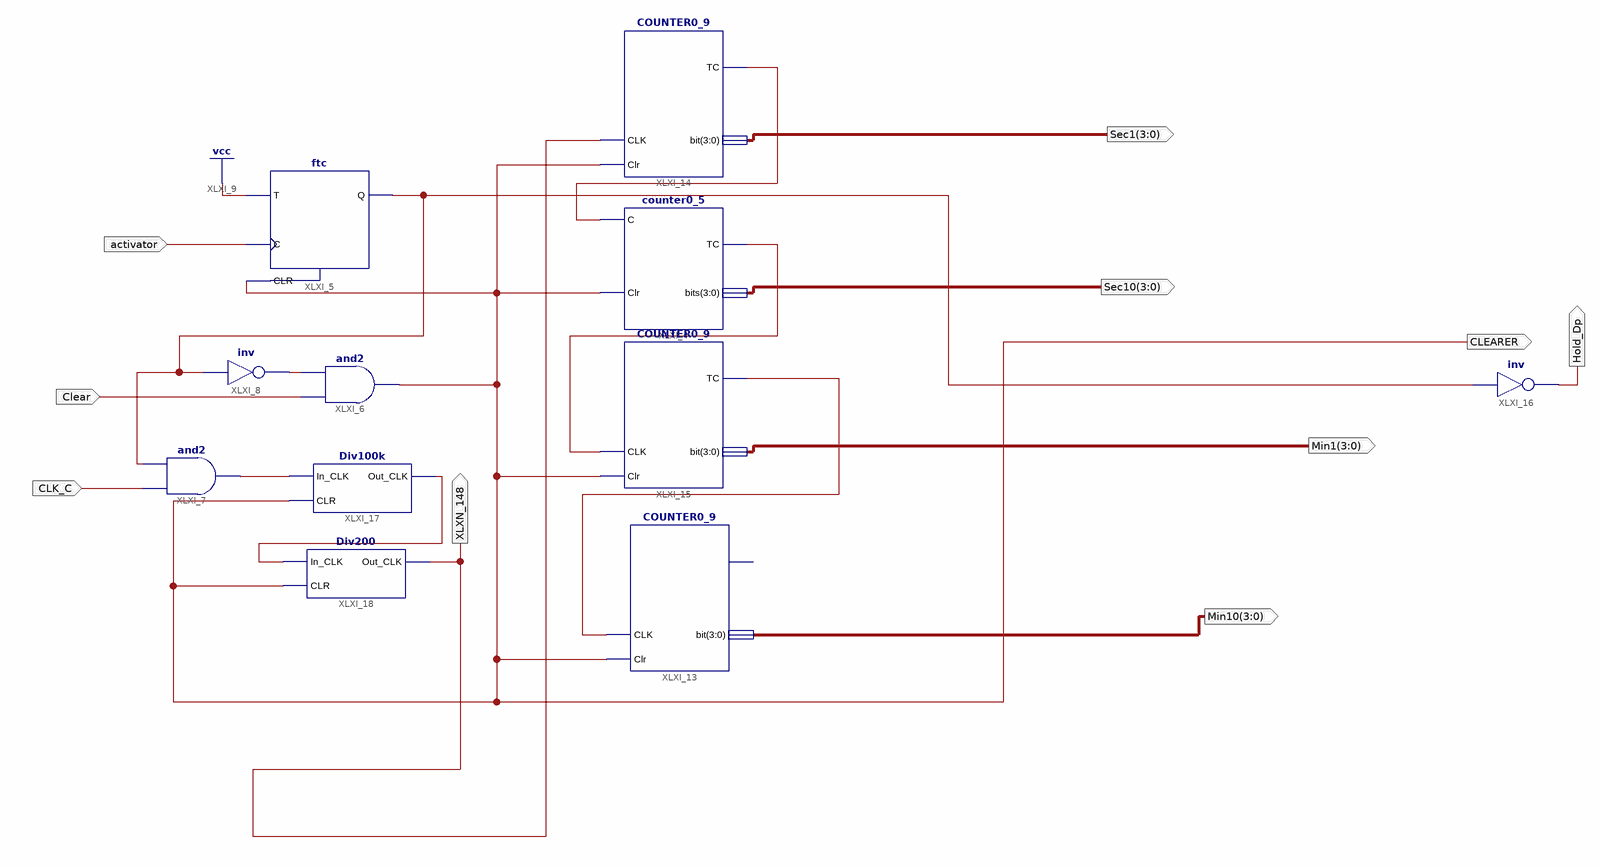
[diagram p0: schematic sheet 1]
// Xilinx ISE schematic Counter.sch (spartan6) as structural Verilog: 11 symbols, 10 ports
module Counter (
  input  activator,
  input  Clear,
  input  CLK_C,
  output CLEARER,
  output [3:0] Sec10,
  output [3:0] Min1,
  output [3:0] Min10,
  output [3:0] Sec1,
  output Hold_Dp,
  output XLXN_148
);

  wire XLXN_3, XLXN_39, XLXN_42, XLXN_47, XLXN_51, XLXN_136, XLXN_146;

  ftc XLXI_5 (.C(activator), .CLR(CLEARER), .T(1'b1), .Q(XLXN_136));
  and XLXI_6 (CLEARER, Clear, XLXN_3);
  not XLXI_8 (XLXN_3, XLXN_136);
  Div200 XLXI_18 (.In_CLK(XLXN_51), .Out_CLK(XLXN_148), .CLR(CLEARER));
  and XLXI_7 (XLXN_146, CLK_C, XLXN_136);
  Div100k XLXI_17 (.In_CLK(XLXN_146), .Out_CLK(XLXN_51), .CLR(CLEARER));
  COUNTER0_9 XLXI_14 (.CLK(XLXN_148), .Clr(CLEARER), .\bit (Sec1), .TC(XLXN_39));
  not XLXI_16 (Hold_Dp, XLXN_136);
  counter0_5 XLXI_4 (.C(XLXN_39), .Clr(CLEARER), .bits(Sec10), .TC(XLXN_42));
  COUNTER0_9 XLXI_15 (.CLK(XLXN_42), .Clr(CLEARER), .\bit (Min1), .TC(XLXN_47));
  COUNTER0_9 XLXI_13 (.CLK(XLXN_47), .Clr(CLEARER), .\bit (Min10));  // open: TC
endmodule
